# Altium schematic sheet MECHANICAL.SchDoc
size Letter; SheetNumber: 4; SheetTotal: 23; Sheet_Name: MECHANICAL; Size: 11x17
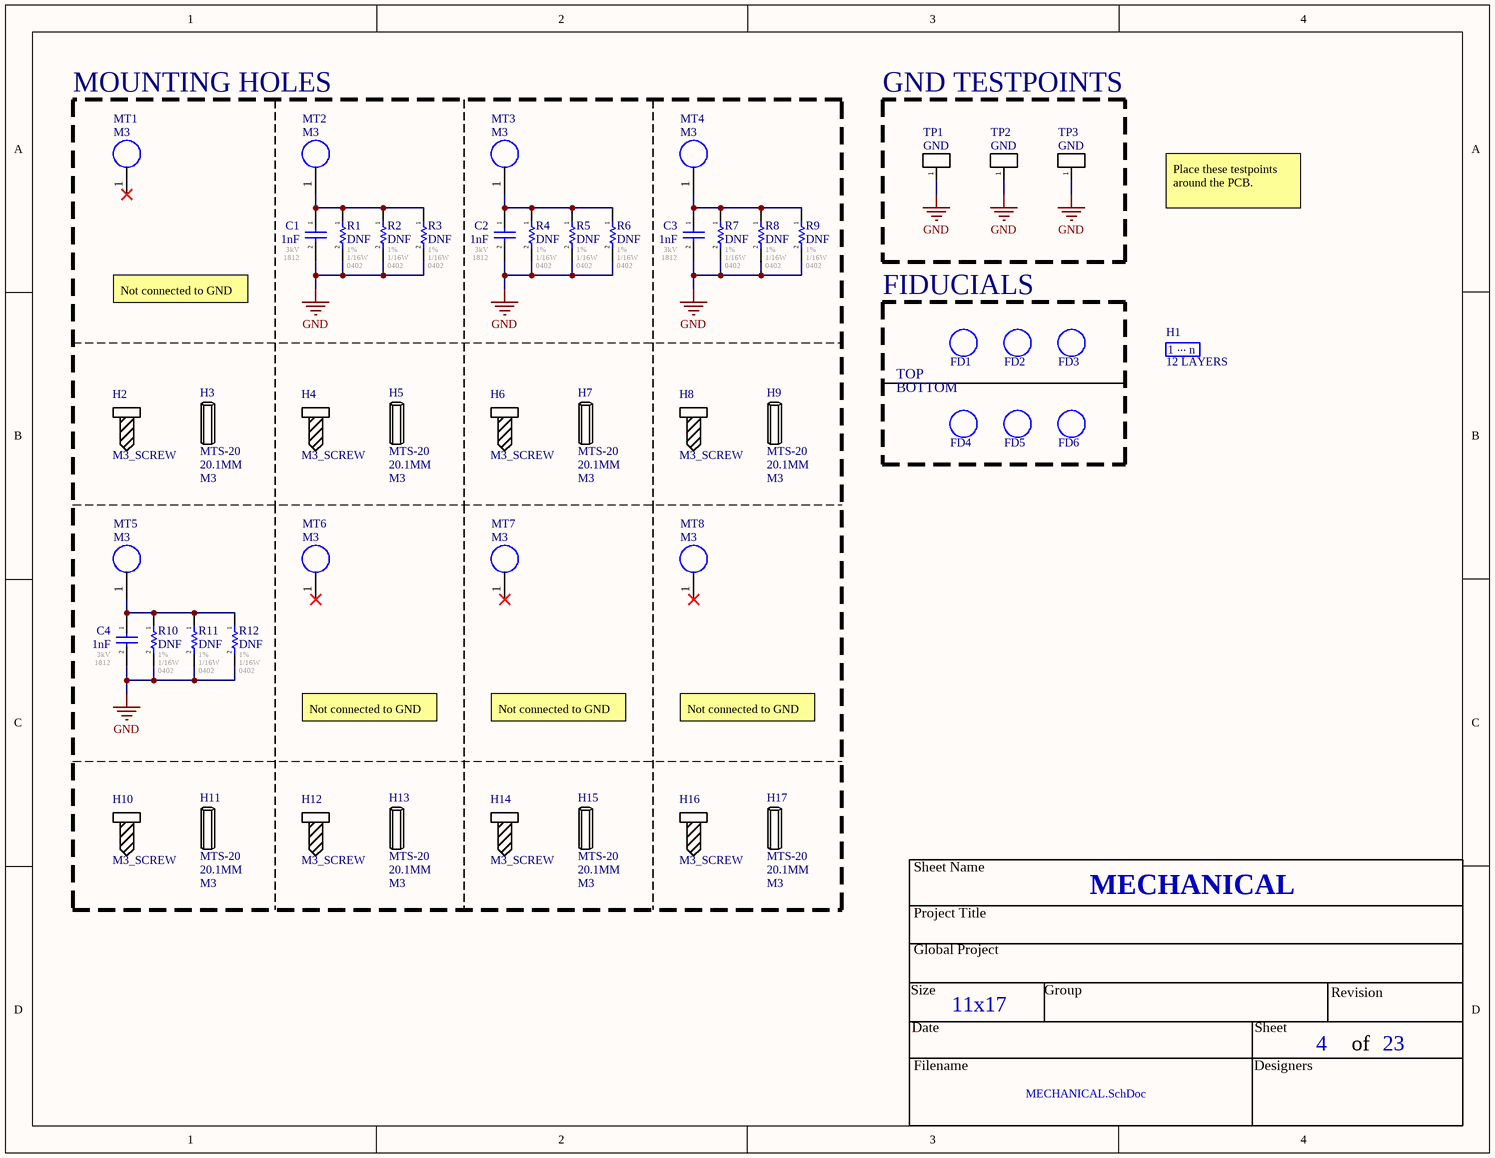
[diagram p0: MECHANICAL.SchDoc]

## Parts
C1  1nF  Voltage - Rated: 3kV  Footprint: 1812  [CAP_1812]
C2  1nF  Voltage - Rated: 3kV  Footprint: 1812  [CAP_1812]
C3  1nF  Voltage - Rated: 3kV  Footprint: 1812  [CAP_1812]
C4  1nF  Voltage - Rated: 3kV  Footprint: 1812  [CAP_1812]
FD1  FIDUCIAL  [FIDUCIAL]  (value not drawn)  (no BOM)
FD2  FIDUCIAL  [FIDUCIAL]  (value not drawn)  (no BOM)
FD3  FIDUCIAL  [FIDUCIAL]  (value not drawn)  (no BOM)
FD4  FIDUCIAL  [FIDUCIAL]  (value not drawn)  (no BOM)
FD5  FIDUCIAL  [FIDUCIAL]  (value not drawn)  (no BOM)
FD6  FIDUCIAL  [FIDUCIAL]  (value not drawn)  (no BOM)
H1  12 LAYERS  [LAYERS_12]  (no BOM)
H2  M3_SCREW  (mechanical)
H3  MTS-20  Length: 20.1MM  Thread Size: M3  [STANDOFF_MTS-20]
H4  M3_SCREW  (mechanical)
H5  MTS-20  Length: 20.1MM  Thread Size: M3  [STANDOFF_MTS-20]
H6  M3_SCREW  (mechanical)
H7  MTS-20  Length: 20.1MM  Thread Size: M3  [STANDOFF_MTS-20]
H8  M3_SCREW  (mechanical)
H9  MTS-20  Length: 20.1MM  Thread Size: M3  [STANDOFF_MTS-20]
H10  M3_SCREW  (mechanical)
H11  MTS-20  Length: 20.1MM  Thread Size: M3  [STANDOFF_MTS-20]
H12  M3_SCREW  (mechanical)
H13  MTS-20  Length: 20.1MM  Thread Size: M3  [STANDOFF_MTS-20]
H14  M3_SCREW  (mechanical)
H15  MTS-20  Length: 20.1MM  Thread Size: M3  [STANDOFF_MTS-20]
H16  M3_SCREW  (mechanical)
H17  MTS-20  Length: 20.1MM  Thread Size: M3  [STANDOFF_MTS-20]
MT1  M3  [MTH_M3]
MT2  M3  [MTH_M3]
MT3  M3  [MTH_M3]
MT4  M3  [MTH_M3]
MT5  M3  [MTH_M3]
MT6  M3  [MTH_M3]
MT7  M3  [MTH_M3]
MT8  M3  [MTH_M3]
R1  DNF  Tolerance: 1%  Power: 1/16W  Package / Case: 0402  [RES_0402]
R2  DNF  Tolerance: 1%  Power: 1/16W  Package / Case: 0402  [RES_0402]
R3  DNF  Tolerance: 1%  Power: 1/16W  Package / Case: 0402  [RES_0402]
R4  DNF  Tolerance: 1%  Power: 1/16W  Package / Case: 0402  [RES_0402]
R5  DNF  Tolerance: 1%  Power: 1/16W  Package / Case: 0402  [RES_0402]
R6  DNF  Tolerance: 1%  Power: 1/16W  Package / Case: 0402  [RES_0402]
R7  DNF  Tolerance: 1%  Power: 1/16W  Package / Case: 0402  [RES_0402]
R8  DNF  Tolerance: 1%  Power: 1/16W  Package / Case: 0402  [RES_0402]
R9  DNF  Tolerance: 1%  Power: 1/16W  Package / Case: 0402  [RES_0402]
R10  DNF  Tolerance: 1%  Power: 1/16W  Package / Case: 0402  [RES_0402]
R11  DNF  Tolerance: 1%  Power: 1/16W  Package / Case: 0402  [RES_0402]
R12  DNF  Tolerance: 1%  Power: 1/16W  Package / Case: 0402  [RES_0402]
TP1  GND  [TP_HOLE]  (no BOM)
TP2  GND  [TP_HOLE]  (no BOM)
TP3  GND  [TP_HOLE]  (no BOM)

## Blocks framed on the sheet
MOUNTING HOLES: C1-C4 H2-H17 MT1-MT8 R1-R12
GND TESTPOINTS: TP1-TP3
FIDUCIALS: FD1-FD6

## Nets
GND: C1.2 C2.2 C3.2 C4.2 R1.2 R2.2 R3.2 R4.2 R5.2 R6.2 R7.2 R8.2 R9.2 R10.2 R11.2 R12.2 TP1.1(A) TP2.1(A) TP3.1(A)
NetC1_1: C1.1 MT2.1 R1.1 R2.1 R3.1
NetC2_1: C2.1 MT3.1 R4.1 R5.1 R6.1
NetC3_1: C3.1 MT4.1 R7.1 R8.1 R9.1
NetC4_1: C4.1 MT5.1 R10.1 R11.1 R12.1

Not connected (* = marked no-connect by the designer): MT1 1*; MT6 1*; MT7 1*; MT8 1*

## Notes on the sheet
- Place these testpoints around the PCB.
- Not connected to GND
- (near FD4) BOTTOM
- TOP
- Sheet Name
- Project Title
- Global Project
- Revision
- Size
- Date
- Group
- Sheet
- of
- Filename
- Designers
- (in symbol MECH_LAYER_MARKER) 1; ...; n

## Library data of the parts
C1-C4 = CAP_CER: C1812C102KHRACAUTO / 0402 470pF 10% X7R Ceramic Capacitor; Mfr: KEMET; Operating Temperature: -55C - 125C; Temperature Coefficient: X7R; ComponentLink1Description: Digikey; ComponentLink1URL: https://www.digikey.com/en/products/detail/kemet/C1812C102KHRACAUTO/8109956; Part#: C1812C102KHRACAUTO; ComponentLink2Description: Datasheet; ComponentLink2URL: https://connect.kemet.com:7667/gateway/IntelliData-ComponentDocumentation/1.0/download/datasheet/C1812C102KHRACAUTO; Tolerance: 10%; Ratings: AEC-Q200; ComponentLink3Description: KEMET; ComponentLink3URL: https://www.kemet.com/en/us/capacitors/ceramic/product/C1812C102KHRACAUTO.html; ComponentLink4Description: Octopart; ComponentLink4URL: https://octopart.com/c1812c102khracauto-kemet-67309371?r=sp; Features: Low ESL, High Voltage; Supplier 1: Mouser; Supplier Part Number 1: 80-C1812C102KHRAUTO
H1 = MECH_LAYER_MARKER
H3 H5 H7 H9 H11 H13 H15 H17 = M3_STANDOFF: Material: *; ComponentLink1Description: Digikey; ComponentLink1URL: https://www.digikey.ca/en/products/detail/essentra-components/mts-20/392825; ComponentLink2Description: Mfr; ComponentLink2URL: https://www.essentracomponents.com/en-ca/p/pcb-standoffs-hexagonal-metric-imperial-threaded-plastic/mts-20; Supplier 1: Digikey; Supplier Part Number 1: RPC1573-ND
MT1-MT8 = MOUNTING_HOLE
R1-R12 = RESISTOR: Automotive: AEC-Q200; Operating Temperature: *; # Digikey: *; ComponentLink1Description: Digikey; ComponentLink1URL: *; # Manufacturer: *
TP1-TP3 = TESTPOINT: Test Point; ClassName: Testpoint